# EAGLE design lazurite_ble_cs75_l2_3 (EAGLE 7.6.0)
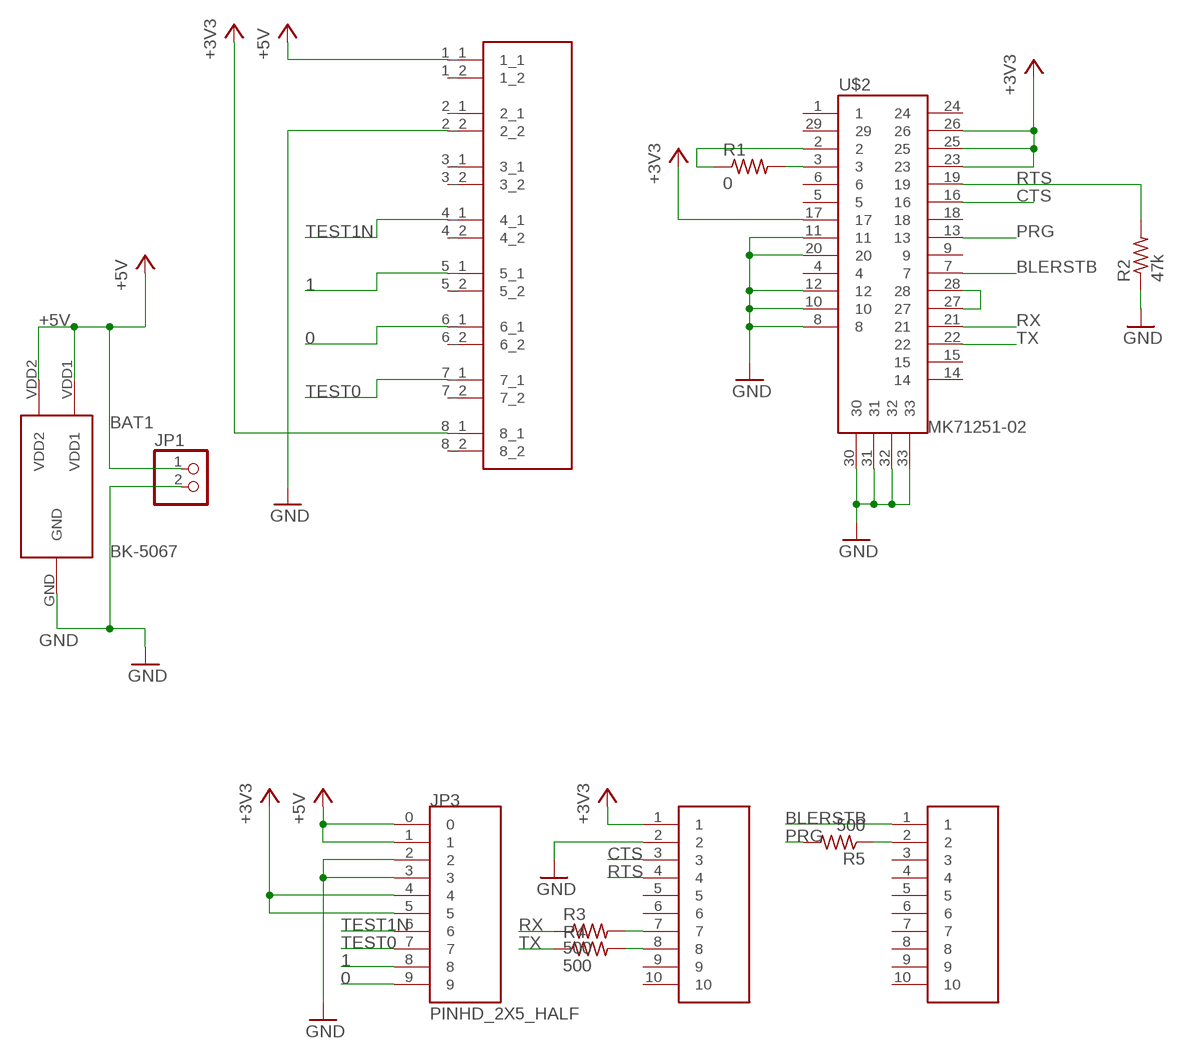
[diagram p0: schematic, sheet 1]

## Parts
BAT1  BK-5067  [BK-5067]
JP1  PINHD-1X2  [1X02]
JP3  PINHD_2X5_HALF  [PINHD_2X5_HALF]
R1  0  R-US_R0402  [R0402]
R2  47k  R-US_R0402  [R0402]
R3  500  R-US_R0402  [R0402]
R4  500  R-US_R0402  [R0402]
R5  500  R-US_R0402  [R0402]
U$1  XB-1-X  [XB-1-X]
U$2  MK71251-02  [MK71251-02]
U$3  PINHD_1_10_HALF  [PINHD_1X10_HALF]
U$4  PINHD_1_10_HALF  [PINHD_1X10_HALF]

## Nets
0: JP3.9 U$1.6_1
1: JP3.8 U$1.5_1
+3V3: JP3.4 JP3.5 U$1.8_1 U$2.17 U$2.23 U$2.25 U$2.26 U$3.1
+5V: BAT1.VDD1 BAT1.VDD2 JP1.1 JP3.0 JP3.1 U$1.1_1
BLERSTB: U$2.7 U$4.1
CTS: U$2.16 U$3.3
GND: BAT1.GND JP1.2 JP3.2 JP3.3 R2.1 U$1.2_2 U$2.8 U$2.10 U$2.11 U$2.12 U$2.20 U$2.30 U$2.31 U$2.32 U$2.33 U$3.2
N$1: R1.2 U$2.3
N$2: R1.1 U$2.2
N$4: U$2.27 U$2.28
N$7: R5.1 U$4.2
N$9: R4.2 U$3.8
N$10: R3.2 U$3.7
PRG: R5.2 U$2.13
RTS: R2.2 U$2.19 U$3.4
RX: R3.1 U$2.21
TEST0: JP3.7 U$1.7_1
TEST1N: JP3.6 U$1.4_1
TX: R4.1 U$2.22
Unconnected: U$1.1_2 U$1.2_1 U$1.3_1 U$1.3_2 U$1.4_2 U$1.5_2 U$1.6_2 U$1.7_2 U$1.8_2 U$2.1 U$2.4 U$2.5 U$2.6 U$2.9 U$2.14 U$2.15 U$2.18 U$2.24 U$2.29 U$3.5 U$3.6 U$3.9 U$3.10 U$4.3 U$4.4 U$4.5 U$4.6 U$4.7 U$4.8 U$4.9 U$4.10

## Library data of the parts
BAT1 = lz-shield:BK-5067
JP1 = pinhead:PINHD-1X2: PIN HEADER
JP3 = lazurite:PINHD_2X5_HALF
R1-R5 = rcl:R-US_: RESISTOR, American symbol
U$1 = lz-shield:XB-1-X
U$2 = lz-shield:MK71251-02
U$3 U$4 = lazurite:PINHD_1_10_HALF

## Board
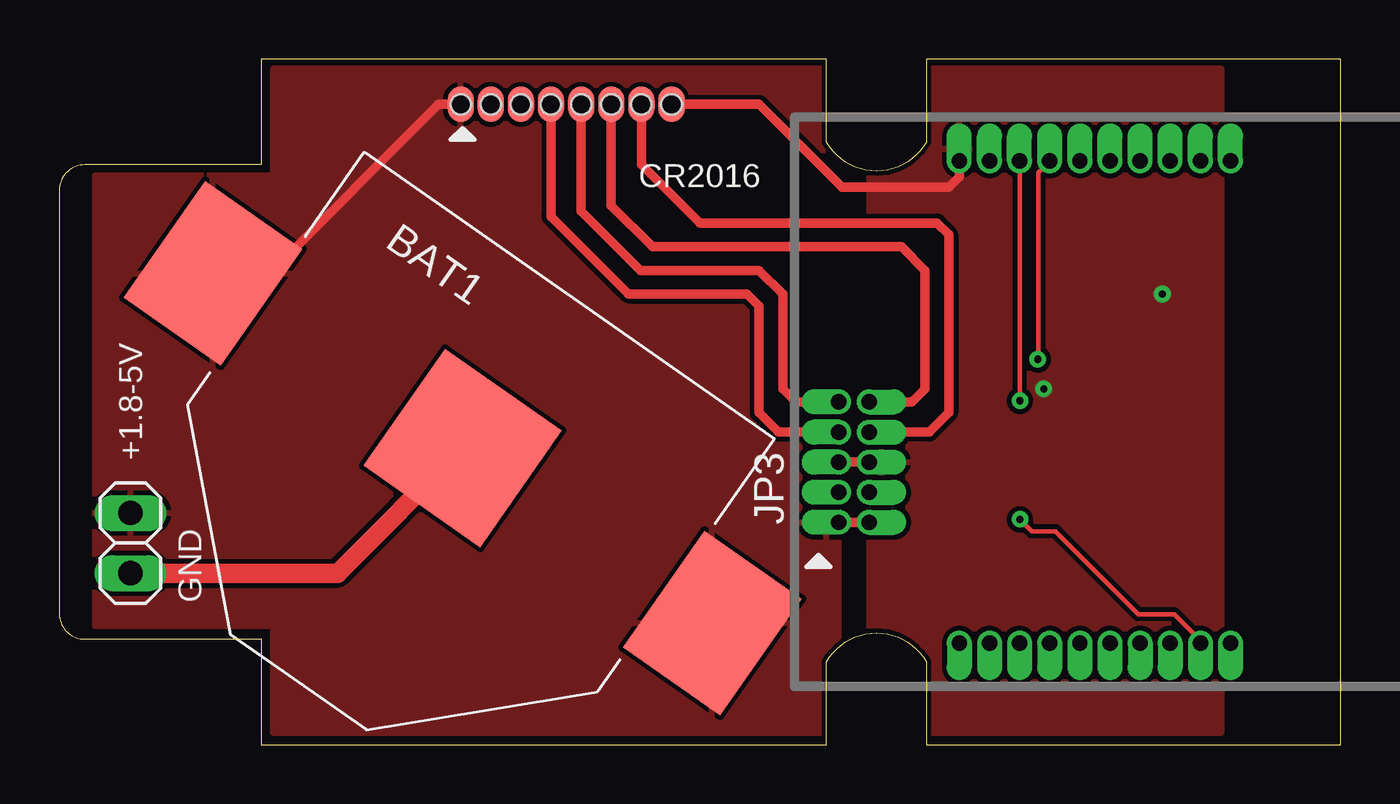
[diagram p1: board, top side]
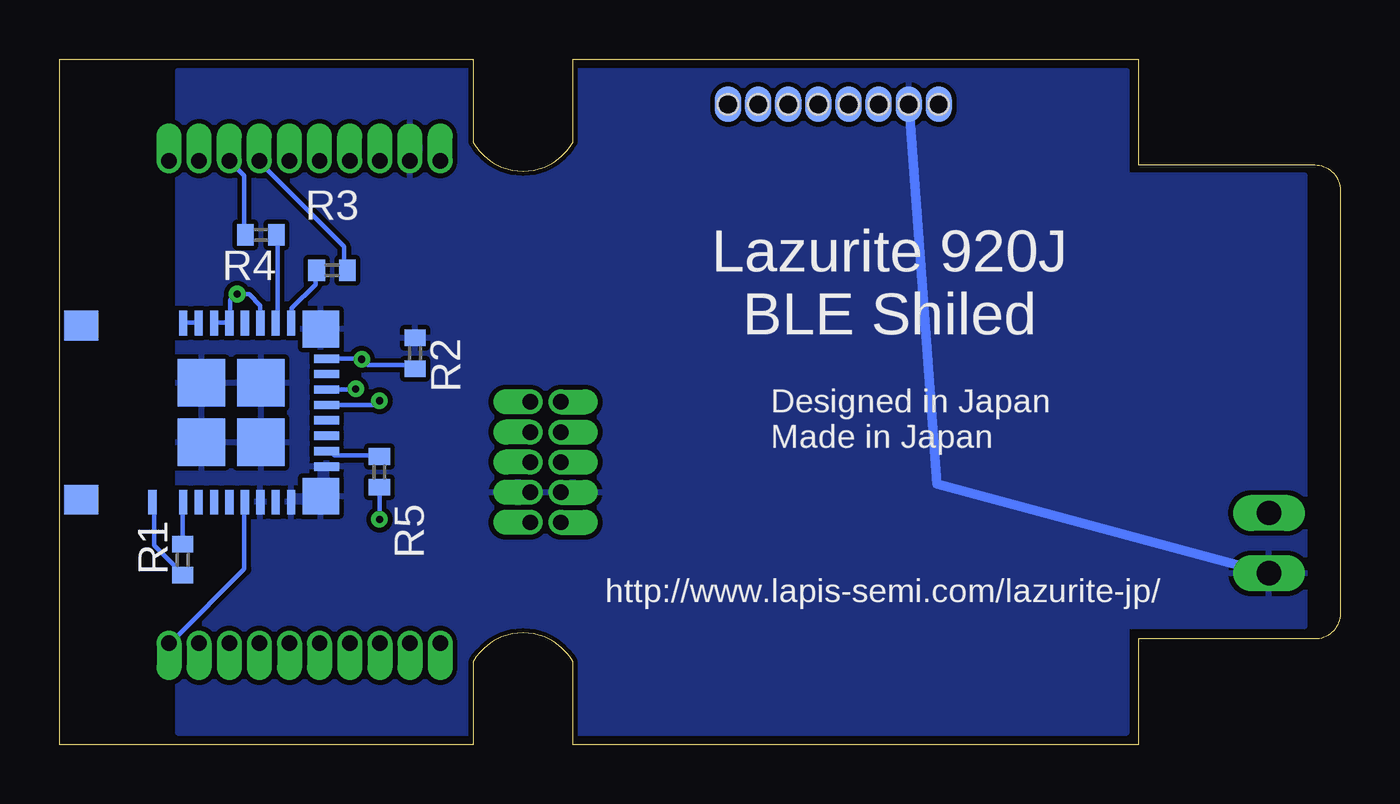
[diagram p2: board, bottom side, seen from below]

Size 54 x 28.9 mm. Coordinates in mm from the lower left corner, seen from the top.
Outline: 8.5,0 32.35,0 32.35,3.5 arc-120 36.55,3.5 36.55,0 54,0 54,28.9 36.55,28.9 36.55,25.4 arc-120 32.35,25.4 32.35,28.9 8.5,28.9 8.5,24.45 1.07,24.45 arc90 0,23.38 0,5.52 arc90 1.07,4.45 8.5,4.45 8.5,0
Copper layers (1*16): Top 0.105mm / dielectric 1.55mm / Bottom 0.105mm
Design rules "kpl__2_layer *": minimum track width 0.2mm, minimum drill 0.3mm, track to track 0.2mm, track to pad 0.2mm, pad to pad 0.2mm, via to via 0.2mm, smd to smd 0mil, copper to edge 0.2mm, drill to drill 0.35mm, minimum pad ring 0.2mm, minimum via ring 0.2mm, stop-mask expansion 0mil, vias tented up to drill 0.45mm, thermal gap 0.2mm

### Footprints (pad centres in the part's own frame; a part is rotated, then mirrored left to right if it is on the bottom)
BK-5067 = smd 6 x 6: GND 0,0 | smd 5 x 6: VDD1 -12.85,0; VDD2 12.85,0
1X02 = drill 1.016 long: 1 -1.27,0; 2 1.27,0
PINHD_2X5_HALF = drill 0.65 pad 0.813 offset: 0 0,0; 1 0,-1.27; 2 -1.27,0; 3 -1.27,-1.27; 4 -2.54,0; 5 -2.54,-1.27; 6 -3.81,0; 7 -3.81,-1.27; 8 -5.08,0; 9 -5.08,-1.27
R0402 = smd 0.7 x 0.9: 1 -0.65,0; 2 0.65,0
XB-1-X = smd 1.1 x 1.5: 1_1 -5.08,0; 2_1 -3.81,0; 3_1 -2.54,0; 4_1 -1.27,0; 5_1 0,0; 6_1 1.27,0; 7_1 2.54,0; 8_1 3.81,0 | smd 1.1 x 1.5 bottom: 1_2 -5.08,0; 2_2 -3.81,0; 3_2 -2.54,0; 4_2 -1.27,0; 5_2 0,0; 6_2 1.27,0; 7_2 2.54,0; 8_2 3.81,0 | hole 0.85: -5.08,0; -3.81,0; -2.54,0; -1.27,0; 0,0; 1.27,0; 2.54,0; 3.81,0
MK71251-02 = smd 1.25 x 1.45: 1 -3.675,5.075; 29 3.675,5.075 | smd 1.05 x 0.35: 2 -3.775,2.075; 3 -3.775,0.775; 4 -3.775,0.125; 5 -3.775,-0.525; 6 -3.775,-1.175; 7 -3.775,-1.825; 8 -3.775,-2.475; 9 -3.775,-3.125; 10 -3.775,-3.775; 21 3.775,-3.775; 22 3.775,-3.125; 23 3.775,-2.475; 24 3.775,-1.825; 25 3.775,-1.175; 26 3.775,-0.525; 27 3.775,0.125; 28 3.775,0.775 | smd 1.55 x 1.55: 11 -3.525,-5.025; 20 3.525,-5.025 | smd 0.35 x 1.05: 12 -2.275,-5.275; 13 -1.625,-5.275; 14 -0.975,-5.275; 15 -0.325,-5.275; 16 0.325,-5.275; 17 0.975,-5.275; 18 1.625,-5.275; 19 2.275,-5.275 | smd 2 x 2: 30 -1.25,0; 31 -1.25,-2.5; 32 1.25,-2.5; 33 1.25,0
PINHD_1X10_HALF = drill 0.65 pad 0.8 offset: 1 0,0; 2 1.27,0; 3 2.54,0; 4 3.81,0; 5 5.08,0; 6 6.35,0; 7 7.62,0; 8 8.89,0; 9 10.16,0; 10 11.43,0

### Placement (x,y rotation side)
BAT1  17,12.5 325 top
JP1  3,8.5 270 top
JP3  32.87,9.37 270 bottom
R1  48.8,7.8 90 bottom
R2  39,16.5 270 bottom
R3  42.5,20 0 bottom
R4  45.5,21.5 180 bottom
R5  40.5,11.5 90 bottom
U$1  22,27 0 top
U$2  48,14 90 bottom
U$3  37.95,24.61 180 bottom
U$4  49.38,4.29 0 bottom

### Tracks (layer width: path | path; a pad name or v marks a point on that pad's centre or on a via)
0
  Top 0.4: JP3.9 35.95,14.45 36.5,15 36.5,20 35.5,21 25,21 23.27,22.73 U$1.6_1
1
  Top 0.4: U$1.5_1 22,22.5 24.5,20 29.5,20 30.5,19 30.5,15 31.05,14.45 JP3.8
+3V3  (via drill 0.3)
  Top 0.4: U$1.8_1 29.5,27 33,23.5 37.5,23.5 37.95,23.95 U$3.1
  Top 0.406: JP3.4 JP3.5
  Bottom 0.2: 46.8,17.8 47.4,17.8 U$2.26 | U$2.17 41.52,14.97 v41.5,15 | U$2.23 45.52,18.52 46,19 v46.5,19 46.55,19 46.8,18.75 46.8,17.8 | 46.8,17.8 U$2.25
  pour Top: 34.14,28.5 34.14,0.5 49,0.5 49,28.5
+5V
  Top 0.4: BAT1.VDD1 8.87,19.87 16,27 U$1.1_1
  Top 0.406: JP3.1 JP3.0
  pour Top: 1.5,24 1.5,5 9,5 9,0.5 32.87,0.5 32.87,28.5 9,28.5 9,24
BLERSTB
  Bottom 0.2: U$2.7 46.2,10.2 46.2,7.4 49.2,4.4 U$4.1
CTS  (via drill 0.3)
  Top 0.2: v40.5,14.5 40.5,24.59 U$3.3
  Bottom 0.2: U$2.16 40.67,14.32 v40.5,14.5
GND
  Top 0.813: JP1.2 11.73,7.23 BAT1.GND
  Bottom 0.4: U$1.2_2 17,11 JP1.2
  pour Bottom: 1.5,24 9,24 9,28.4 49,28.4 49,0.5 9,0.5 9,5 1.5,5
N$1
  Bottom 0.2: R1.2 48.8,10.2 U$2.3
N$2
  Bottom 0.2: R1.1 48.8,7.2 50,8.4 50,10.2 U$2.2
N$4
  Bottom 0.2: U$2.27 48.2,17.8 48.8,17.8 U$2.28
N$7  (via drill 0.3)
  Top 0.2: U$4.2 48.1,4.39 47,5.5 45.5,5.5 42,9 41,9 v40.5,9.5
  Bottom 0.2: v40.5,9.5 R5.1
N$9
  Bottom 0.2: R4.2 46.2,21.6 46.2,24 46.8,24.6 U$3.8
N$10
  Bottom 0.2: R3.2 42,20 42,21 45.6,24.6 U$3.7
PRG
  Bottom 0.2: R5.2 40.6,12.2 42.4,12.2 42.6,12.4 U$2.13
RTS  (via drill 0.3)
  Top 0.2: U$3.4 41.27,24.13 41.27,16.4 | 41.27,16.4 41.27,16.27 | v41.25,16.25 41.2,16.4 41.27,16.4
  Bottom 0.2: U$2.19 41.27,16.27 v41.25,16.25 41,16 39.15,16 R2.2
RX
  Bottom 0.2: R3.1 43.2,20 43.2,19.4 44.2,18.4 44.2,17.8 U$2.21
TEST0
  Top 0.4: U$1.7_1 24.54,24.46 27,22 37,22 37.5,21.5 37.5,14 36.68,13.18 JP3.7
TEST1N
  Top 0.4: U$1.4_1 20.73,22.27 24,19 29,19 29.5,18.5 29.5,14 30.32,13.18 JP3.6
TX
  Bottom 0.2: R4.1 44.8,21.4 44.8,17.8 U$2.22

### Text on the board
tPlace: CR2016 | +1.8-5V | GND
bPlace: Lazurite 920J / BLE Shiled | Designed in Japan / Made in Japan | http://www.lapis-semi.com/lazurite-jp/